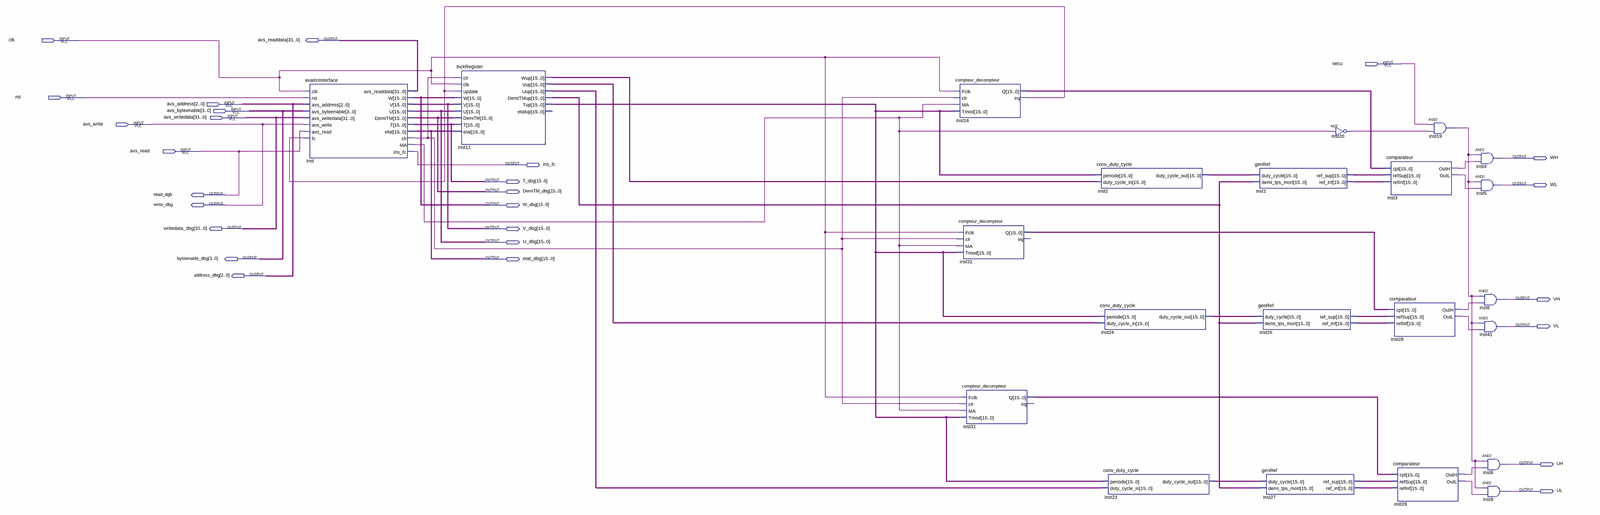
[diagram p0: schematic sheet, whole]
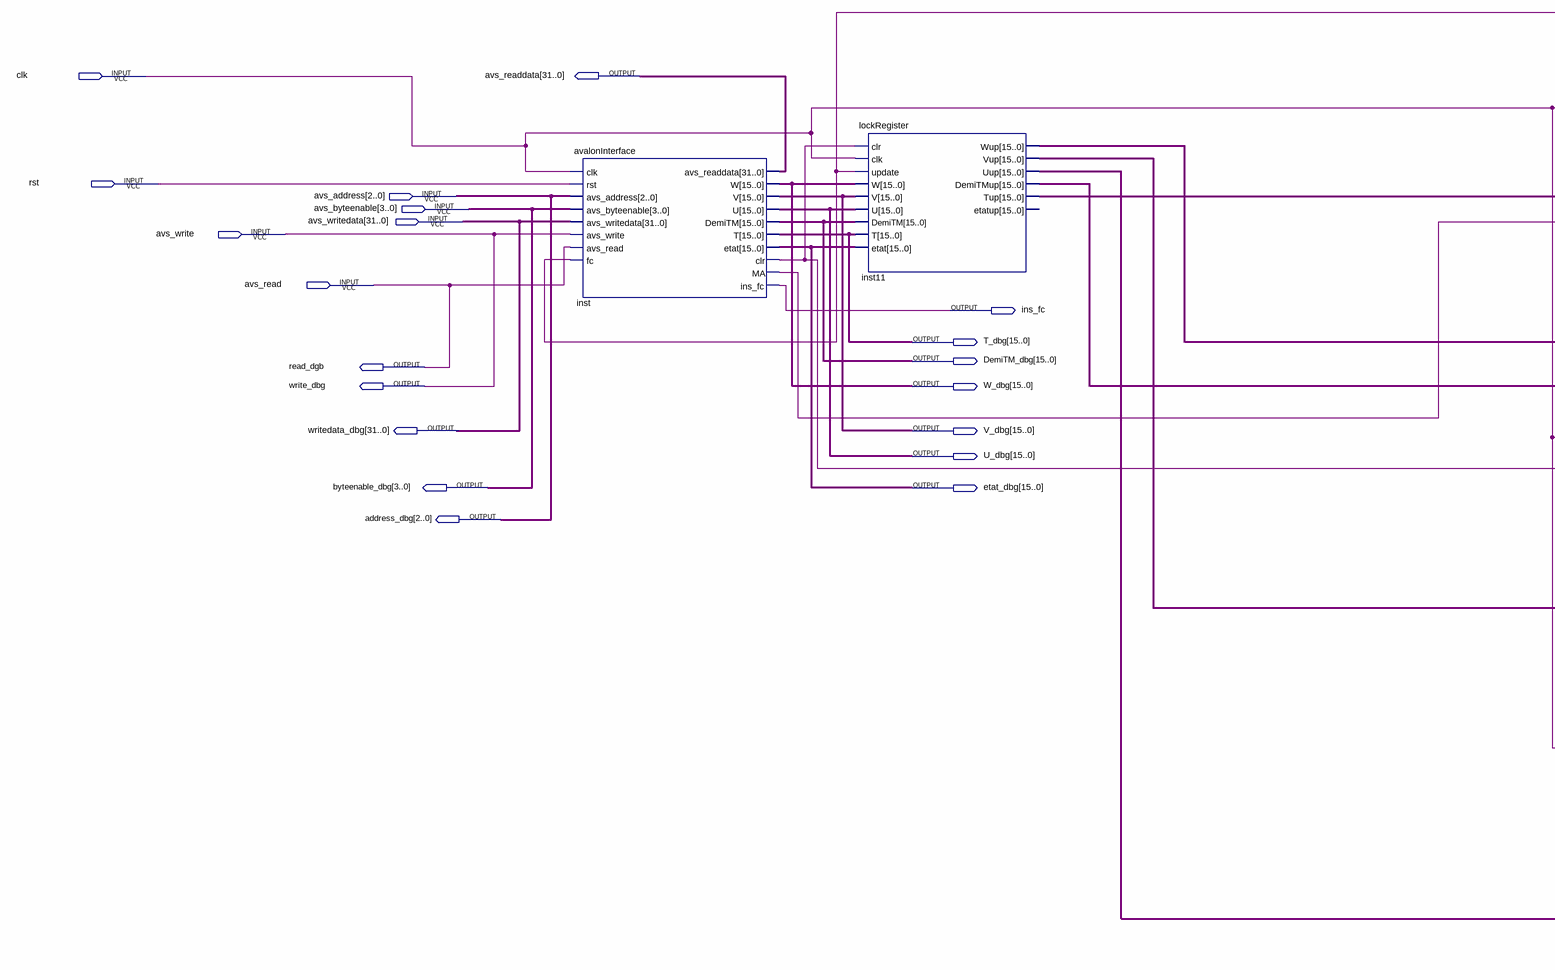
[diagram p1: schematic sheet, left part]
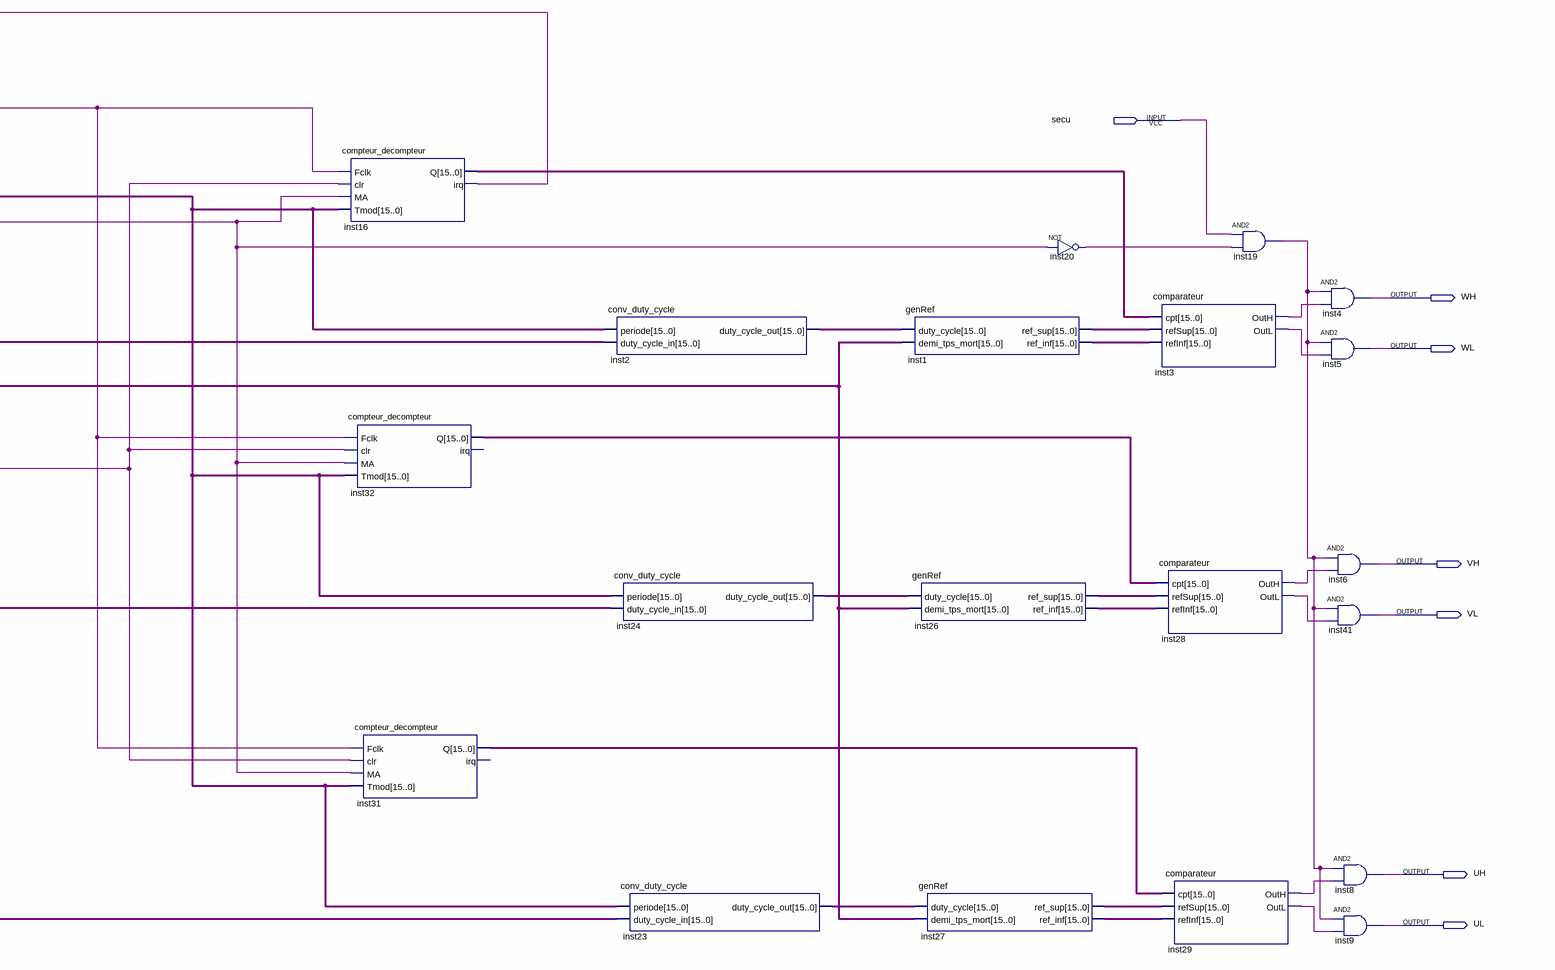
[diagram p2: schematic sheet, right part]
// Quartus schematic Onduleur_tri.bdf as structural Verilog: 22 symbols, 27 pins
module Onduleur_tri (
  input  clk,
  input  secu,
  input  rst,
  input  [2:0] avs_address,
  input  [3:0] avs_byteenable,
  input  [31:0] avs_writedata,
  input  avs_write,
  input  avs_read,
  output [31:0] avs_readdata,
  output WH,
  output ins_fc,
  output [15:0] T_dbg,
  output WL,
  output [15:0] DemiTM_dbg,
  output read_dgb,
  output write_dbg,
  output [15:0] W_dbg,
  output [31:0] writedata_dbg,
  output [15:0] V_dbg,
  output [15:0] U_dbg,
  output [3:0] byteenable_dbg,
  output [15:0] etat_dbg,
  output [2:0] address_dbg,
  output VH,
  output VL,
  output UH,
  output UL
);

  wire inst3_outh, inst3_outl, inst16_irq, inst19_out, inst20_out, inst28_outh, inst28_outl, inst29_outh,
       inst29_outl, inst_clr, inst_ma;
  wire [15:0] inst1_ref_inf, inst1_ref_sup, inst2_duty_cycle_out, inst11_demitmup, inst11_tup, inst11_uup,
       inst11_vup, inst11_wup, inst16_q, inst23_duty_cycle_out, inst24_duty_cycle_out, inst26_ref_inf,
       inst26_ref_sup, inst27_ref_inf, inst27_ref_sup, inst31_q, inst32_q;

  avalonInterface inst (
    .clk(clk), .rst(rst), .avs_address(avs_address), .avs_byteenable(avs_byteenable),
    .avs_writedata(avs_writedata), .avs_write(avs_write), .avs_read(avs_read), .fc(inst16_irq),
    .avs_readdata(avs_readdata), .W(W_dbg), .V(V_dbg), .U(U_dbg), .DemiTM(DemiTM_dbg), .T(T_dbg),
    .etat(etat_dbg), .clr(inst_clr), .MA(inst_ma), .ins_fc(ins_fc));
  lockRegister inst11 (
    .clr(inst_clr), .clk(clk), .update(inst16_irq), .W(W_dbg), .V(V_dbg), .U(U_dbg), .DemiTM(DemiTM_dbg),
    .T(T_dbg), .etat(etat_dbg), .Wup(inst11_wup), .Vup(inst11_vup), .Uup(inst11_uup),
    .DemiTMup(inst11_demitmup), .Tup(inst11_tup));  // open: etatup
  compteur_decompteur inst16 (
    .Fclk(clk), .clr(inst_clr), .MA(inst_ma), .Tmod(inst11_tup), .Q(inst16_q), .irq(inst16_irq));
  compteur_decompteur inst32 (.Fclk(clk), .clr(inst_clr), .MA(inst_ma), .Tmod(inst11_tup), .Q(inst32_q));  // open: irq
  compteur_decompteur inst31 (.Fclk(clk), .clr(inst_clr), .MA(inst_ma), .Tmod(inst11_tup), .Q(inst31_q));  // open: irq
  conv_duty_cycle inst2 (.periode(inst11_tup), .duty_cycle_in(inst11_wup), .duty_cycle_out(inst2_duty_cycle_out));
  conv_duty_cycle inst24 (.periode(inst11_tup), .duty_cycle_in(inst11_vup), .duty_cycle_out(inst24_duty_cycle_out));
  conv_duty_cycle inst23 (.periode(inst11_tup), .duty_cycle_in(inst11_uup), .duty_cycle_out(inst23_duty_cycle_out));
  genRef inst1 (
    .duty_cycle(inst2_duty_cycle_out), .demi_tps_mort(inst11_demitmup), .ref_sup(inst1_ref_sup),
    .ref_inf(inst1_ref_inf));
  genRef inst26 (
    .duty_cycle(inst24_duty_cycle_out), .demi_tps_mort(inst11_demitmup), .ref_sup(inst26_ref_sup),
    .ref_inf(inst26_ref_inf));
  genRef inst27 (
    .duty_cycle(inst23_duty_cycle_out), .demi_tps_mort(inst11_demitmup), .ref_sup(inst27_ref_sup),
    .ref_inf(inst27_ref_inf));
  not inst20 (inst20_out, inst_ma);
  comparateur inst3 (
    .cpt(inst16_q), .refSup(inst1_ref_sup), .refInf(inst1_ref_inf), .OutH(inst3_outh), .OutL(inst3_outl));
  comparateur inst28 (
    .cpt(inst32_q), .refSup(inst26_ref_sup), .refInf(inst26_ref_inf), .OutH(inst28_outh), .OutL(inst28_outl));
  comparateur inst29 (
    .cpt(inst31_q), .refSup(inst27_ref_sup), .refInf(inst27_ref_inf), .OutH(inst29_outh), .OutL(inst29_outl));
  and inst19 (inst19_out, secu, inst20_out);
  and inst4 (WH, inst19_out, inst3_outh);
  and inst5 (WL, inst19_out, inst3_outl);
  and inst6 (VH, inst19_out, inst28_outh);
  and inst41 (VL, inst19_out, inst28_outl);
  and inst8 (UH, inst19_out, inst29_outh);
  and inst9 (UL, inst19_out, inst29_outl);

  assign address_dbg = avs_address;
  assign byteenable_dbg = avs_byteenable;
  assign read_dgb = avs_read;
  assign write_dbg = avs_write;
  assign writedata_dbg = avs_writedata;
endmodule
